# Altium schematic sheet Low-Current Power Supply.SchDoc: Low-Current Power Supply
size 228 x 165 mm; DrawnBy: Joseph Riesen; DocumentNumber: 5; Revision: 1.0; SheetNumber: 5; SheetTotal: 10
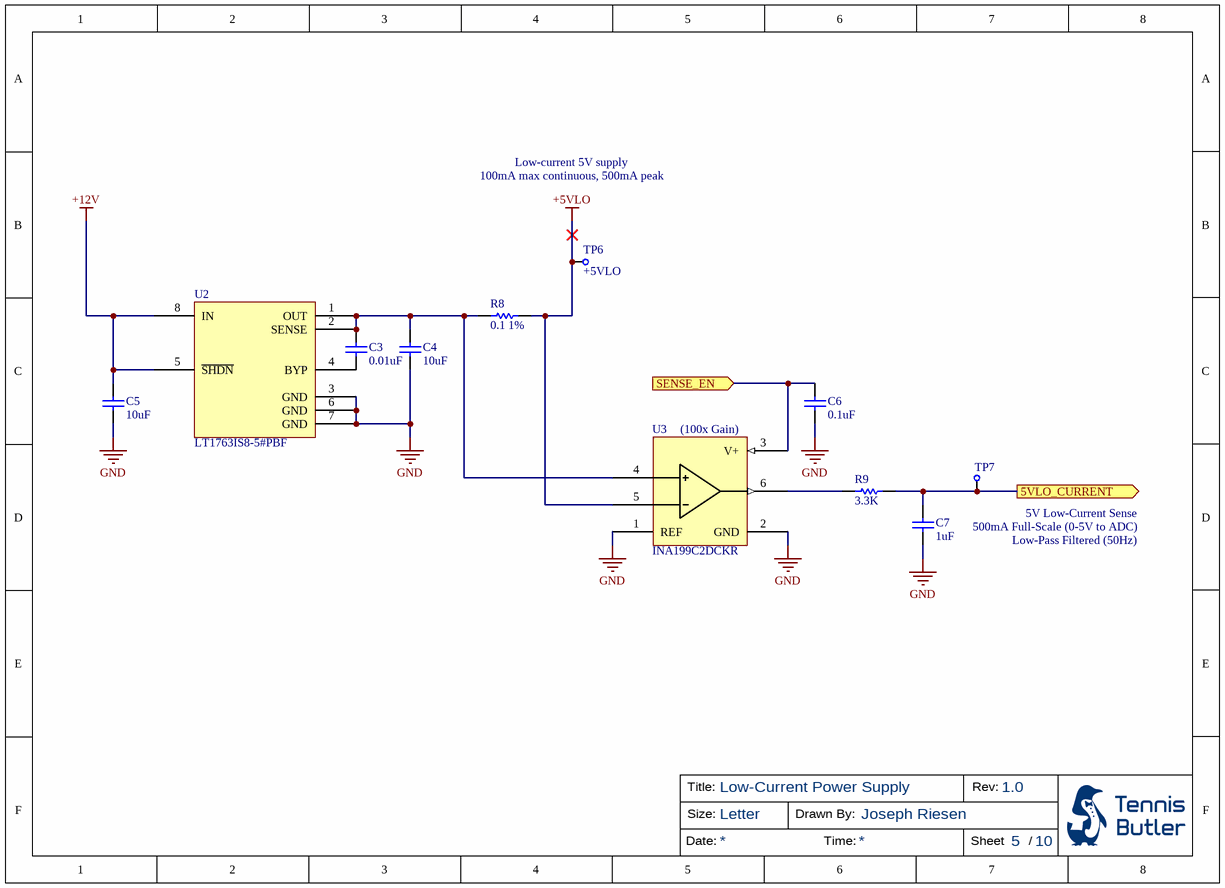
[diagram p0: Low-Current Power Supply.SchDoc]

## Parts
C3  0.01uF  [CAPC1608X87X35ML15T15]
C4  10uF  [CAPC2013X145X50ML20T25]
C5  10uF  [CAPC2013X145X50ML20T25]
C6  0.1uF  [CAPC0805(2012)100_M]
C7  1uF  [CAPC2013X100X50ML20T25]
R8  0.1 1%  [RESC3216X70X50NL05T20]
R9  3.3K  [RESC2013X70X40ML20T20]
TP6  +5VLO  [Test Point]  (no BOM)
TP7  5VLO CSENSE  [Test Point]  (value not drawn)  (no BOM)
U2  LT1763IS8-5#PBF  [SOIC127P600X175-8M]
U3  INA199C2DCKR  [TSOP65P240X110-6M]

## Ports
5VLO_CURRENT (out), SENSE_EN (in)

## Nets
+5VLO: R8.2 TP6.1 U3.5(IN-)
+12V: C5.2 U2.5(~{SHDN}) U2.8(IN)
GND: C4.1 C5.1 C6.1 C7.1 U2.3(GND) U2.6(GND) U2.7(GND) U3.1(REF) U3.2(GND)
5VLO_CURRENT: C7.2 R9.2 TP7.1 ; port 5VLO_CURRENT
SENSE_EN: C6.2 U3.3(V+) ; port SENSE_EN
NetC3_1: C3.1 U2.4(BYP)
NetC3_2: C3.2 C4.2 R8.1 U2.1(OUT) U2.2(SENSE) U3.4(IN+)
NetR9_1: R9.1 U3.6(OUT)

## Notes on the sheet
- Low-current 5V supply
  100mA max continuous, 500mA peak
- (near U3) (100x Gain)
- 5V Low-Current Sense
  500mA Full-Scale (0-5V to ADC)
  Low-Pass Filtered (50Hz)
- Title:
- Size:
- Letter
- Drawn By:
- Rev:
- Date:
- Time:
- Sheet
- /

## Library data of the parts
C3 = CMP-2006-03030-1: Manufacturer: Kemet; Part Number: C0603C103J3GACTU
C4 C5 = CMP-2007-01006-1: Manufacturer: Kemet; Part Number: C0805C106K9PACTU
C6 = CMP-1036-04391-1: CAP 100nF 6.3V ±10% 0805 (2012 Metric) Thickness 1mm SMD; Case-EIA: 0805; Case-Metric: 2012; Tolerance: Â±10%; Rated Voltage: 6.3 V; Technology: SMT; Value: 100nF; Max Thickness: 1 mm
C7 = CMP-2007-03677-1: Manufacturer: Kemet; Part Number: C0805C105K9RACTU
R8 = CMP-2003-00708-1: Part Number: ERJ-L08KF10CV; Manufacturer: Panasonic
R9 = CMP-2001-00533-1: RES SMD 3.3K OHM 1% 1/8W 0805; Manufacturer: Panasonic; Part Number: ERJ6ENF3301V
TP6 TP7 = Test Point
U2 = LT1763IS8-5#PBF: IC REG LINEAR 5V 500MA 8SOIC; Manufacturer: Analog Devices / Linear Technology; Dropout Voltage: 300mV; Number of Outputs: 1; Max Input Voltage: 20V; Min Input Voltage: 1.8V; Min Current Limit: 520mA; Polarity: Positive; Operating Supply Current: 30uA; Power Supply Rejection Ratio (PSRR): 65dB; Output Type: Fixed; Supplier 1: Digi-Key; Manufacturer Part Number: LT1763IS8-5#PBF; Stock 1: 1418; Pricing 1: 1 = 5.20000, 25 = 3.45400, 100 = 2.85600, 250 = 2.71320, 500 = 2.65200 (USD); RoHS 1: Yes; Case/Package: SOIC; Number of Pins: 8; Min Operating Temperature: -40°C; Max Operating Temperature: 125°C; Output Current: 500mA; Package Quantity: 100; Packaging: Rail/Tube; Output Voltage: 5V; Nominal Output Voltage: 5V; Number of Regulators: 1; REACH SVHC: No SVHC; ComponentLink1URL: https://datasheet.ciiva.com/22659/1599494-22659223.pdf?src-supplier=Farnell; ComponentLink1Description: Datasheet 2 (Farnell); ComponentLink2URL: https://datasheet.ciiva.com/2058/3903-2058730.pdf?src-supplier=Digi-Key; ComponentLink2Description: Datasheet 1 (Digi-Key); Supplier Part Number 1: LT1763IS8-5#PBF-ND
U3 = INA199C2DCKR: IC OP AMP CURR SENSE SC70-6; Manufacturer: Texas Instruments; Supplier 1: Digi-Key; Manufacturer Part Number: INA199C2DCKR; Stock 1: 3000; Pricing 1: 1 = 0.90000, 10 = 0.80200, 100 = 0.62540, 500 = 0.51664, 1000 = 0.40788 (USD); RoHS 1: No; Min Operating Temperature: -40°C; Max Operating Temperature: 125°C; ComponentLink1URL: http://www.ti.com/lit/pdf/slyb194?src-supplier=Digi-Key; ComponentLink1Description: http://www.ti.com/lit/pdf/slyb194?src-supplier=Digi-Key; Supplier Part Number 1: 296-49644-1-ND